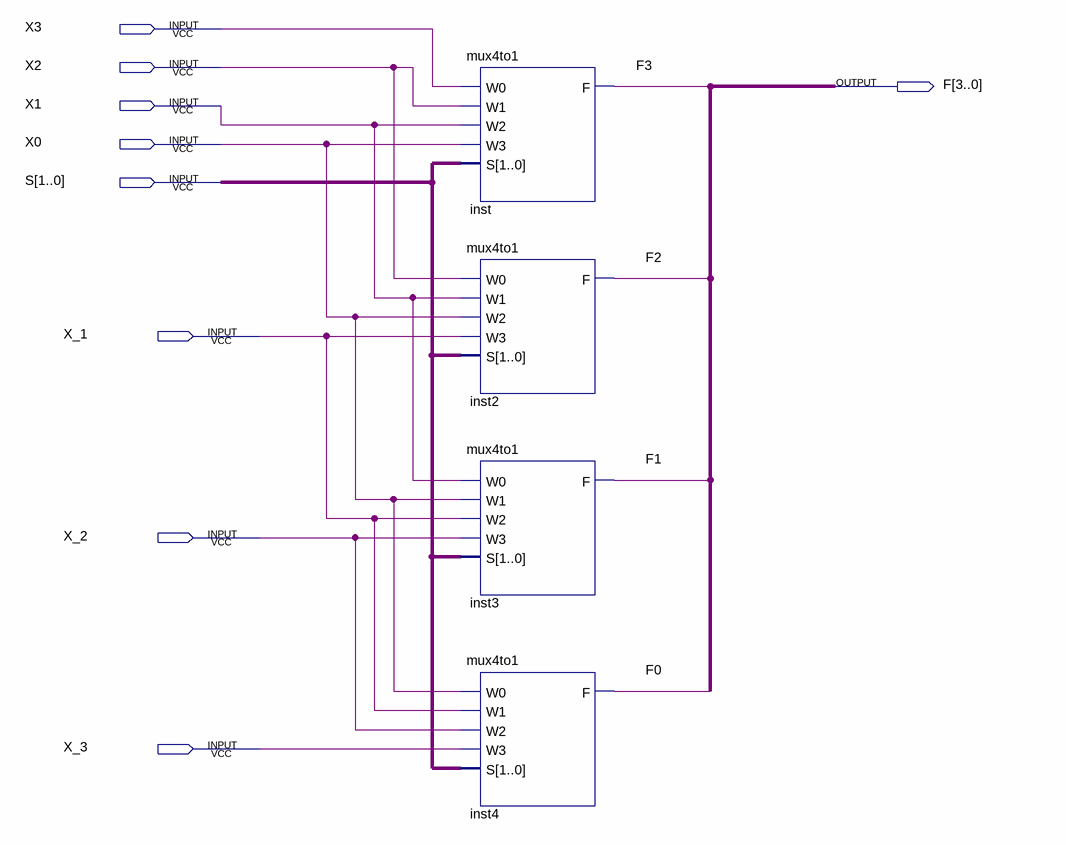
[diagram p0: schematic sheet]
// Quartus schematic lab8step2.bdf as structural Verilog: 4 symbols, 9 pins
module lab8step2 (
  input  X3,
  input  X2,
  input  X1,
  input  X0,
  input  [1:0] S,
  input  X_1,
  input  X_2,
  input  X_3,
  output [3:0] F
);

  mux4to1 inst (.W0(X3), .W1(X2), .W2(X1), .W3(X0), .S(S), .F(F[3]));
  mux4to1 inst2 (.W0(X2), .W1(X1), .W2(X0), .W3(X_1), .S(S), .F(F[2]));
  mux4to1 inst3 (.W0(X1), .W1(X0), .W2(X_1), .W3(X_2), .S(S), .F(F[1]));
  mux4to1 inst4 (.W0(X0), .W1(X_1), .W2(X_2), .W3(X_3), .S(S), .F(F[0]));
endmodule
